# Altium schematic sheet Howland Channel 4.SchDoc
size A4
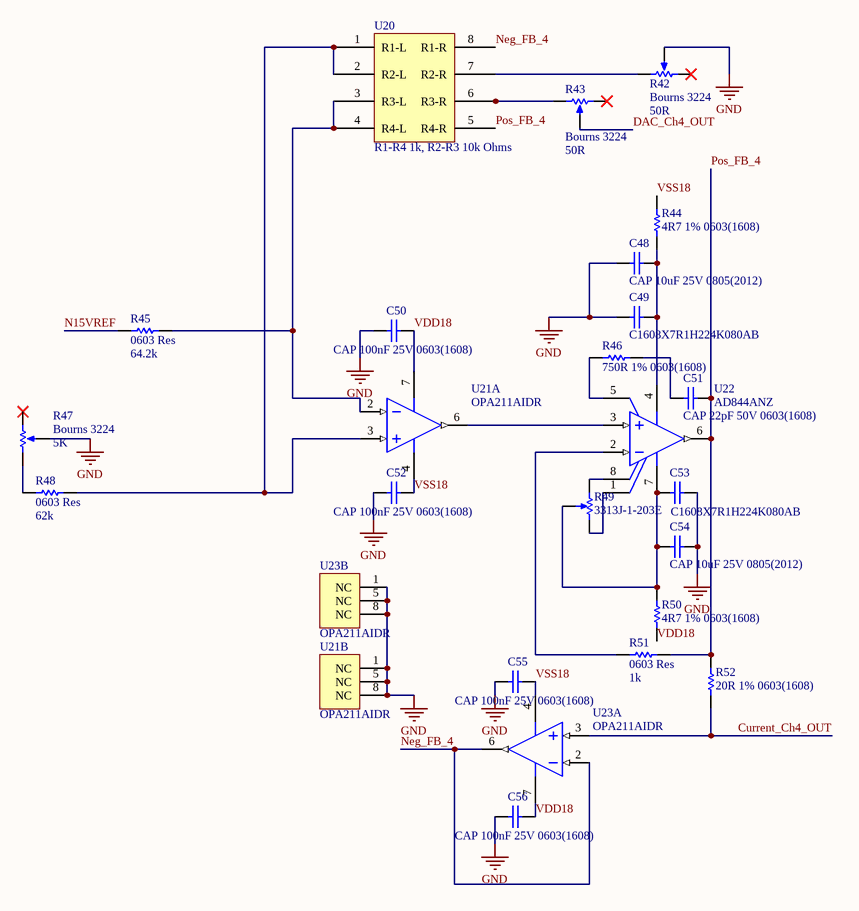
[diagram p0: Howland Channel 4.SchDoc]

## Parts
C48  CAP 10uF 25V 0805(2012)  [CAPC0805(2012)145_N]
C49  C1608X7R1H224K080AB  [TDK-C1608-2_A_M]
C50  CAP 100nF 25V 0603(1608)  [CAPC0603(1608)100_N]
C51  CAP 22pF 50V 0603(1608)  [CAPC0603(1608)100_M]
C52  CAP 100nF 25V 0603(1608)  [CAPC0603(1608)100_N]
C53  C1608X7R1H224K080AB  [TDK-C1608-2_A_M]
C54  CAP 10uF 25V 0805(2012)  [CAPC0805(2012)145_N]
C55  CAP 100nF 25V 0603(1608)  [CAPC0603(1608)100_N]
C56  CAP 100nF 25V 0603(1608)  [CAPC0603(1608)100_N]
R42  Bourns 3224  value 50R  [BOURNS 3224W]
R43  Bourns 3224  value 50R  [BOURNS 3224W]
R44  4R7 1% 0603(1608)  [RESC0603(1608)_M]
R45  0603 Res  value 64.2k  [J1-0603]
R46  750R 1% 0603(1608)  [RESC0603(1608)_L]
R47  Bourns 3224  value 5K  [BOURNS 3224W]
R48  0603 Res  value 62k  [J1-0603]
R49  3313J-1-203E  [BOUR-3313J-1_V]
R50  4R7 1% 0603(1608)  [RESC0603(1608)_M]
R51  0603 Res  value 1k  [J1-0603]
R52  20R 1% 0603(1608)  [RESC0603(1608)_M]
U20  R1-R4 1k, R2-R3 10k Ohms  [0612 (4x0603)]
U21  OPA211AIDR  [TI-D8_L]  (parts A,B of 2)
U22  AD844ANZ  [ADI-N-8]
U23  OPA211AIDR  [TI-D8_L]  (parts A,B of 2)

## Nets
GND: C48.1 C49.1 C50.1 C52.1 C53.2 C54.2 C55.1 C56.1 R42.2(TAP) R47.2(TAP) U21.1(NC) U21.5(NC) U21.8(NC) U23.1(NC) U23.5(NC) U23.8(NC)
Current_Ch4_OUT: R52.1 U23.3(IN+)
DAC_Ch4_OUT: R43.2(TAP)
N15VREF: R45.2
Neg_FB_4: U20.8(R1-R) U23.2(IN-) U23.6(OUT)
Pos_FB_4: C51.2 R51.1 R52.2 U20.5(R4-R) U22.6(OUTPUT)
VDD18: C50.2 C56.2 R50.1 U21.7(V+) U23.7(V+)
VSS18: C52.2 C55.2 R44.2 U21.4(V-) U23.4(V-)
NetC48_2: C48.2 C49.2 R44.1 U22.4(-VS)
NetC51_1: C51.1 R46.2
NetC53_1: C53.1 C54.1 R49.2 R50.2 U22.7(+VS)
NetR42_3: R42.3(BOT) U20.7(R2-R)
NetR43_1: R43.1(TOP) U20.6(R3-R)
NetR45_1: R45.1 U20.3(R3-L) U20.4(R4-L) U21.2(IN-)
NetR46_1: R46.1 U22.5(TZ)
NetR47_1: R47.1(TOP) R48.2
NetR48_1: R48.1 U20.1(R1-L) U20.2(R2-L) U21.3(IN+)
NetR49_1: R49.1 U22.8(NULL)
NetR49_3: R49.3 U22.1(NULL)
NetR51_2: R51.2 U22.2(-IN)
NetU21_6: U21.6(OUT) U22.3(+IN)

Not connected (* = marked no-connect by the designer): R42 1(TOP)*; R43 3(BOT)*; R47 3(BOT)*

## Library data of the parts
C48 C54 = CMP-1036-04932-1: CAP 10uF 25V ±10% 0805 (2012 Metric) Thickness 1.45mm SMD; Case-EIA: 0805; Case-Metric: 2012; Tolerance: Â±10%; Technology: SMT; Value: 10uF; Rated Voltage: 25 V; Max Thickness: 1.45 mm
C49 C53 = CMP-2000-05394-1: Cap Ceramic, 0.22 uF, +/- 10%, -55 to 125 degC, 2-Pin SMD (0603), RoHS, Tape and Reel; Manufacturer: TDK; PCN Part Number: MLCCPartNumberChange30/Nov/2012; Capacitance: 0.22µF; Other Names: 445-7408-1; Design Resources: 20WNon-IsolatedBuckLEDDriverUsingPLLNK460KG; Online Catalog: CSeries,GeneralPurpose; Kits: 445-9014-KIT-ND-KITMLCC100PF-22UF060310-50V445-9003-KIT-ND-KITCAPCERHICAPMLCCSMD445-173086-KIT-ND-C0402-2220X7R6.3-50V1,000PF-; Temperature Coefficient: X7R; Product Training Modules: CSeriesGeneralApplicationsSEAT,CCV,andTVCLDesignToolsGuidetoReplacinganElectrolyticCapacitorwithanMLCC; Voltage - Rated: 50V; Ratings: -; Lead Spacing: -; Package Description: 2-Pin Chip Capacitor, Body 1.7 x 0.9 mm; Datasheet URL: https://datasheet.ciiva.com/24218/c1608x7r1h224k080ab-264841-24218813.pdf; Applications: GeneralPurpose; Series: C; Manufacturer URL: http://www.tdk.com/; Features: -; Tolerance: ±10%; Package Reference: 603; Family: CeramicCapacitors; Standard Package: 1; RoHS Information: RoHSCertificate-MLCC; Package / Case: 0603(1608Metric); Operating Temperature: -55degC~125degC; Datasheet Version: Sep-13; Mounting Type: SurfaceMount,MLCC; Lead Style: -; Height - Seated (Max): -; Packaging: CutTape(CT); Category: Capacitors
C50 C52 C55 C56 = CMP-1035-02589-1: CAP 100nF 25V ±20% 0603 (1608 Metric) Thickness 1mm SMD; Case-EIA: 0603; Tolerance: Â±20%; Case-Metric: 1608; Value: 100nF; Max Thickness: 1 mm; Technology: SMT; Rated Voltage: 25 V
C51 = CMP-1035-00820-1: CAP 22pF 50V ±2% 0603 (1608 Metric) Thickness 1mm SMD; Case-Metric: 1608; Case-EIA: 0603; Tolerance: Â±2%; Rated Voltage: 50 V; Value: 22pF; Technology: SMT; Max Thickness: 1 mm
R42 R43 R47 = 3224-Series Trimmer Potentiometer: Trimmer Potentiometer, Cermet, 3224-Series (Bourns); Sim Note: Enter the Resistance value and the set point into parameter fields.; Set Position: 0.5; Published: 8-Jun-2000; LatestRevisionDate: 17-Jul-2002; LatestRevisionNote: Re-released for DXP Platform.; PackageReference: VR5; Publisher: Altium Limited; PackageDescription: Variable Resistor, Thru-Hole; 3 Leads
R44 R50 = CMP-1012-00247-1: 4R7 0.1W 1% 0603 (1608 Metric)  SMD; Case-EIA: 0603; Case-Metric: 1608; Value: 4.70 Ohm; Power: 0.1 W; Technology: SMT; Tolerance: 1 %
R45 R48 R51 = Res1: Chip Resistor, 0603, 1%; Published: 8-Jun-2000; LatestRevisionDate: 17-Jul-2002; LatestRevisionNote: Re-released for DXP Platform.; PackageReference: AXIAL-0.3; Publisher: Altium Limited; PackageDescription: Axial Device, Thru-Hole; 2 Leads; 0.3 in Pin Spacing
R46 = CMP-1012-00496-1: 750R 0.1W 1% 0603 (1608 Metric)  SMD; Value: 750.00 Ohm; Case-Metric: 1608; Case-EIA: 0603; Technology: SMT; Tolerance: 1 %; Power: 0.1 W
R49 = CMP-2000-05586-1: 3 mm Trimpot(R) Trimming Potentiometer, 20 KOhm, +/- 20%, 0.125 W, -55 to 125 degC, 3-Pin SMD, RoHS, Tape and Reel; Manufacturer: Bourns; Insulation Resistance: 100Megohms(Min.)@500VDC; Rotational Life: 100Cycles; Resolution: Infinite; Brand/Series: Trimpot®3313-SealedSeries; Temperature, Operating, Maximum: +125°C; Resistance: 20Kilohms; Resistance, Insulation: 100Megohms; Material, Element: Cermet; Standards: RoHSCompliant; Dielectric Strength: 500VAC; Load Life: 1000hr@0.125W,70°C; Torque: 50g-cm; Temperature Coefficient: ±100ppm/°C; Number of Turns: 1; Power, Rating: 0.125W; Angle, Mechanical: 250°; Temperature, Operating, Minimum: -55°C; Package Reference: 3313J-1; Tolerance: ±20%; Type: Trimmer; Package Description: 3-Pin Surface Mount Device, Body 3.5 x 3.2 mm, Pitch 1.15 mm; Mounting Technology: SurfaceMount; Datasheet URL: http://www.bourns.com/docs/Product-Datasheets/3313.pdf; Mounting Type: SurfaceMount; Manufacturer URL: http://www.bourns.com/; Datasheet Version: 05/2016; Termination: SMD
R52 = CMP-1012-00316-1: 20R 0.1W 1% 0603 (1608 Metric)  SMD; Case-EIA: 0603; Case-Metric: 1608; Value: 20.00 Ohm; Technology: SMT; Tolerance: 1 %; Power: 0.1 W
U20 = VISHAY ACAS: Matched Resistor Network, Isolated, multi-0603 package, Abs Tol 0.1%, Rel Tol 0.05%
U21 U23 = CMP-0272-00537-2: 1.1 nV/rtHz Noise, Low Power, Precision Operational Amplifier, 4.5 to 36 V, -40 to 125 degC, 8-pin SOIC (D8), Green (RoHS & no Sb/Br); Manufacturer: Texas Instruments; Total Supply Voltage(Min)(+5V is 5, +/-5V is 10): 4.5; Number of Channels: 1; Offset Drift(Typ)(uV/C): 0.15; GBW(Typ)(MHz): 45; Slew Rate(Typ)(V/us): 27; Sub Family: High Supply Voltage Amplifier (>=30V), Low Noise Amp (<=10nV/rtHz), Low Offset Voltage Amplifier (<=500uV), Precision Amplifier; Rating: Catalog; IIB(Max)(pA): 175000; Vio (25C)(Max)(mV): 0.125; Packing: LARGE T&R; Total Supply Voltage(Max)(+5V is 5, +/-5V is 10): 36; CMRR(Min)(dB): 114; Eco-Plan: Green (RoHS & no Sb/Br); DatasheetVersion: SBOS377G; Iq per channel(Max)(mA): 4.5; ComponentLink2URL: http://www.ti.com/lit/ds/symlink/opa211.pdf; ComponentLink1Description: Manufacturer URL; ComponentLink3Description: Package Specification; Code_JEDEC: MS-012; ComponentLink3URL: http://www.ti.com/litv/pdf/msoi002j; PartNumber: OPA211AIDR; ComponentLink2Description: Datasheet; PackageReference: D8; PackageVersion: 4040047-3/M, 06/2011; ComponentLink1URL: http://www.ti.com/; Mounting Technology: Surface Mount; PackageDescription: 8-Pin Plastic Small Outline, Body 4.9 x 3.9 mm, Pitch 1.27 mm; PartId: 1
U22 = CMP-0384-00240-1: Single Channel Wide Bandwidth Operational Amplifier, 60 MHz BW, 2 KV/us SR, Industrial, 8-pin DIP (N-8), Tube; Generic Part Number: AD844; Manufacturer: Analog Devices; Amplifiers Per Package: 1; Small Signal Bandwidth: 60MHz; Iq/Amp: 6.5mA; V Span Max: 36V; V Span Min: 9V; Slew Rate: 2KV/us; Input Bias Current: 150nA; Input Offset Voltage: 50uV; Code_JEDEC: MS-001; PackageDescription: 8-Pin Plastic Dual In-Line Package, Row spacing 7.62 mm, Pitch 2.54 mm; DatasheetVersion: Rev. F; ComponentLink2URL: http://www.analog.com/static/imported-files/data_sheets/AD844.pdf; PackageReference: N-8; ComponentLink2Description: Datasheet; PartNumber: AD844ANZ; ComponentLink1URL: http://www.analog.com/en/index.html; ComponentLink3Description: Package Specification; Mounting Technology: Through Hole; ComponentLink3URL: http:/www.analog.com/static/imported-files/packages/PKG_PDF/PDIP(N)/N_8.pdf; ComponentLink1Description: Manufacturer URL; PackageVersion: 070606-A; Packing: Tube